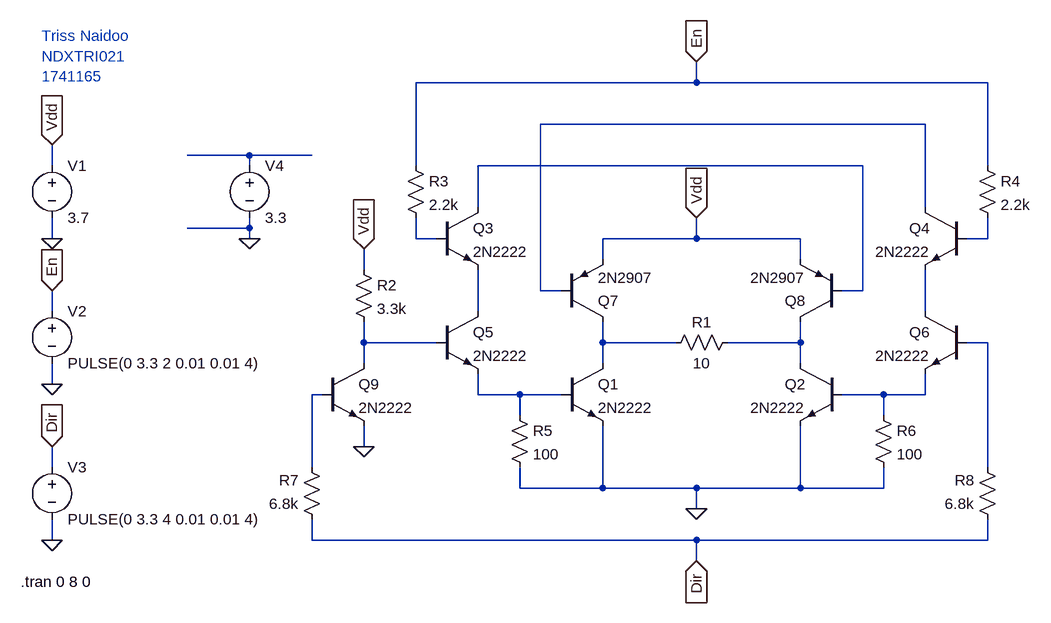
[diagram p0: schematic EEE3088F_Motor_Driver_Simulation.asc]
EEE3088F_Motor_Driver_Simulation.asc, the LTspice schematic file:
Version 4
SHEET 1 2324 680
WIRE 272 -352 272 -384
WIRE 272 -352 -160 -352
WIRE 720 -352 272 -352
WIRE 624 -288 32 -288
WIRE -416 -240 -512 -240
WIRE -320 -240 -416 -240
WIRE -720 -224 -720 -256
WIRE -416 -224 -416 -240
WIRE -160 -224 -160 -352
WIRE 528 -224 -64 -224
WIRE 720 -224 720 -352
WIRE -64 -160 -64 -224
WIRE 624 -160 624 -288
WIRE -416 -128 -416 -144
WIRE -416 -128 -512 -128
WIRE -720 -112 -720 -144
WIRE -416 -112 -416 -128
WIRE -160 -112 -160 -144
WIRE -128 -112 -160 -112
WIRE 272 -112 272 -144
WIRE 272 -112 128 -112
WIRE 432 -112 272 -112
WIRE 720 -112 720 -144
WIRE 720 -112 688 -112
WIRE 128 -80 128 -112
WIRE 432 -80 432 -112
WIRE -240 -64 -240 -96
WIRE 32 -32 32 -288
WIRE 64 -32 32 -32
WIRE 528 -32 528 -224
WIRE 528 -32 496 -32
WIRE -720 0 -720 -32
WIRE -64 0 -64 -64
WIRE 624 0 624 -64
WIRE -240 48 -240 16
WIRE -128 48 -240 48
WIRE 128 48 128 16
WIRE 240 48 128 48
WIRE 432 48 432 16
WIRE 432 48 320 48
WIRE 720 48 688 48
WIRE -240 80 -240 48
WIRE 128 80 128 48
WIRE 432 80 432 48
WIRE -720 112 -720 80
WIRE -304 128 -320 128
WIRE -64 128 -64 96
WIRE 0 128 -64 128
WIRE 64 128 0 128
WIRE 560 128 496 128
WIRE 624 128 624 96
WIRE 624 128 560 128
WIRE 0 160 0 128
WIRE 560 160 560 128
WIRE -240 208 -240 176
WIRE -720 240 -720 208
WIRE -320 240 -320 128
WIRE 720 240 720 48
WIRE 0 272 0 240
WIRE 128 272 128 176
WIRE 128 272 0 272
WIRE 272 272 128 272
WIRE 432 272 432 176
WIRE 432 272 272 272
WIRE 560 272 560 240
WIRE 560 272 432 272
WIRE 272 304 272 272
WIRE -720 352 -720 320
WIRE -320 352 -320 320
WIRE 272 352 -320 352
WIRE 720 352 720 320
WIRE 720 352 272 352
WIRE 272 384 272 352
FLAG 272 304 0
FLAG 272 -144 Vdd
IOPIN 272 -144 In
FLAG -720 -256 Vdd
IOPIN -720 -256 In
FLAG 272 384 Dir
IOPIN 272 384 In
FLAG 272 -384 En
IOPIN 272 -384 In
FLAG -720 -112 0
FLAG -240 -96 Vdd
IOPIN -240 -96 In
FLAG -720 -32 En
IOPIN -720 -32 In
FLAG -720 208 Dir
IOPIN -720 208 In
FLAG -720 112 0
FLAG -720 352 0
FLAG -240 208 0
FLAG -416 -112 0
SYMBOL npn 64 80 R0
SYMATTR InstName Q1
SYMATTR Value 2N2222
SYMBOL res 224 64 R270
WINDOW 0 32 56 VTop 2
WINDOW 3 0 56 VBottom 2
SYMATTR InstName R1
SYMATTR Value 10
SYMBOL voltage -720 -240 R0
WINDOW 123 0 0 Left 0
WINDOW 39 0 0 Left 0
SYMATTR InstName V1
SYMATTR Value 3.7
SYMBOL res -256 -80 R0
SYMATTR InstName R2
SYMATTR Value 3.3k
SYMBOL res -176 -240 R0
SYMATTR InstName R3
SYMATTR Value 2.2k
SYMBOL npn 496 80 M0
SYMATTR InstName Q2
SYMATTR Value 2N2222
SYMBOL npn -128 -160 R0
SYMATTR InstName Q3
SYMATTR Value 2N2222
SYMBOL npn 688 -160 M0
SYMATTR InstName Q4
SYMATTR Value 2N2222
SYMBOL npn -128 0 R0
SYMATTR InstName Q5
SYMATTR Value 2N2222
SYMBOL npn 688 0 M0
SYMATTR InstName Q6
SYMATTR Value 2N2222
SYMBOL pnp 64 16 M180
SYMATTR InstName Q7
SYMATTR Value 2N2907
SYMBOL pnp 496 16 R180
SYMATTR InstName Q8
SYMATTR Value 2N2907
SYMBOL npn -304 80 R0
SYMATTR InstName Q9
SYMATTR Value 2N2222
SYMBOL voltage -720 -16 R0
WINDOW 123 0 0 Left 0
WINDOW 39 0 0 Left 0
SYMATTR InstName V2
SYMATTR Value PULSE(0 3.3 2 0.01 0.01 4)
SYMBOL voltage -720 224 R0
WINDOW 123 0 0 Left 0
WINDOW 39 0 0 Left 0
SYMATTR InstName V3
SYMATTR Value PULSE(0 3.3 4 0.01 0.01 4)
SYMBOL res -16 144 R0
SYMATTR InstName R5
SYMATTR Value 100
SYMBOL res 544 144 R0
SYMATTR InstName R6
SYMATTR Value 100
SYMBOL voltage -416 -240 R0
WINDOW 123 0 0 Left 0
WINDOW 39 0 0 Left 0
SYMATTR InstName V4
SYMATTR Value 3.3
SYMBOL res -304 336 R180
WINDOW 0 36 76 Left 2
WINDOW 3 36 40 Left 2
SYMATTR InstName R7
SYMATTR Value 6.8k
SYMBOL res 736 336 R180
WINDOW 0 36 76 Left 2
WINDOW 3 36 40 Left 2
SYMATTR InstName R8
SYMATTR Value 6.8k
SYMBOL res 704 -240 R0
SYMATTR InstName R4
SYMATTR Value 2.2k
TEXT -768 416 Left 2 !.tran 0 8 0
TEXT -736 -424 Left 2 ;Triss Naidoo\nNDXTRI021\n1741165

The netlist it stands for:
* EEE3088F_Motor_Driver_Simulation.asc
Q1 N009 N013 0 0 2N2222
R1 N009 N010 10
V1 Vdd 0 3.7
R2 Vdd N008 3.3k
R3 En N004 2.2k
Q2 N010 N014 0 0 2N2222
Q3 N003 N004 N006 0 2N2222
Q4 N001 N005 N007 0 2N2222
Q5 N006 N008 N013 0 2N2222
Q6 N007 N011 N014 0 2N2222
Q7 N009 N001 Vdd 0 2N2907
Q8 N010 N003 Vdd 0 2N2907
Q9 N008 N012 0 0 2N2222
V2 En 0 PULSE(0 3.3 2 0.01 0.01 4)
V3 Dir 0 PULSE(0 3.3 4 0.01 0.01 4)
R5 N013 0 100
R6 N014 0 100
V4 N002 0 3.3
R7 Dir N012 6.8k
R8 Dir N011 6.8k
R4 En N005 2.2k
.model NPN NPN
.model PNP PNP
.lib standard.bjt
.tran 0 8 0
* Triss Naidoo
* NDXTRI021
* 1741165
.backanno
.end